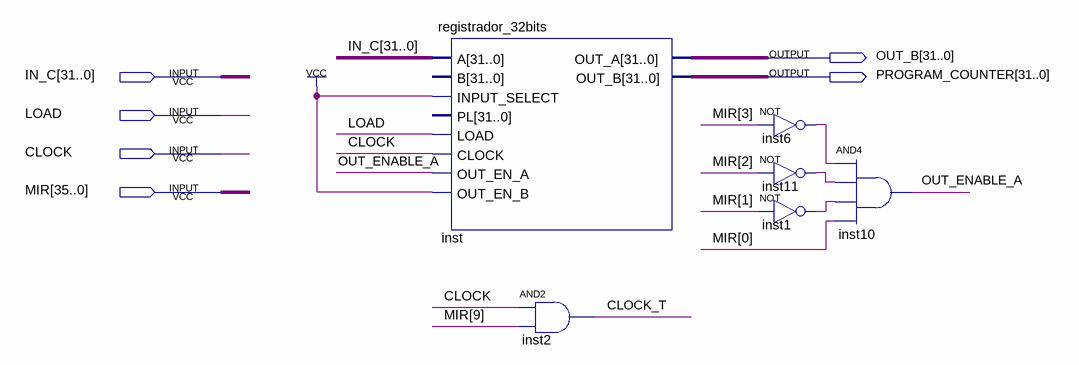
[diagram p0: schematic sheet]
// Quartus schematic PC.bdf as structural Verilog: 6 symbols, 6 pins
module PC (
  input  [31:0] IN_C,
  input  LOAD,
  input  CLOCK,
  input  [35:0] MIR,
  output [31:0] OUT_B,
  output [31:0] PROGRAM_COUNTER
);

  wire CLOCK_T, inst1_out, inst6_out, inst11_out, OUT_ENABLE_A;

  registrador_32bits inst (
    .A(IN_C), .INPUT_SELECT(1'b1), .LOAD(LOAD), .CLOCK(CLOCK), .OUT_EN_A(OUT_ENABLE_A), .OUT_EN_B(1'b1),
    .OUT_A(OUT_B), .OUT_B(PROGRAM_COUNTER));  // open: B, PL
  and inst2 (CLOCK_T, CLOCK, MIR[9]);
  not inst6 (inst6_out, MIR[3]);
  not inst11 (inst11_out, MIR[2]);
  not inst1 (inst1_out, MIR[1]);
  and inst10 (OUT_ENABLE_A, inst6_out, inst11_out, inst1_out, MIR[0]);
endmodule
